# Altium schematic sheet MCP2515.SchDoc
size 297 x 209 mm
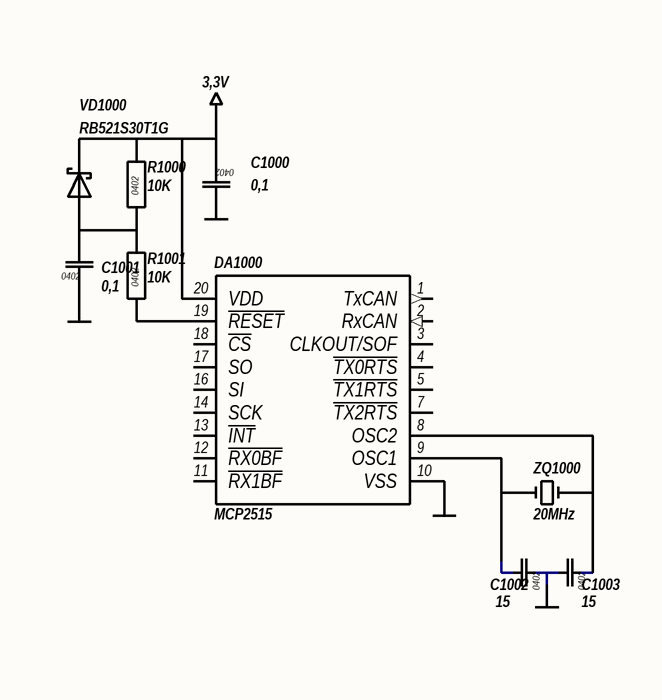
[diagram p0: MCP2515.SchDoc]

## Parts
C1000  0,1  [CAP0402]
C1001  0,1  [CAP0402]
C1002  15  [CAP0402]
C1003  15  [CAP0402]
DA1000  MCP2515  [SSOP20-4.4]
R1000  10K  [RES0402]
R1001  10K  [RES0402]
VD1000  RB521S30T1G  [SOD-523F]
ZQ1000  20MHz  [KX-7]

## Nets
3,3V: C1000.1 DA1000.20(VDD) R1000.2 VD1000.2
GND: C1000.2 C1001.1 C1002.1 C1003.2 DA1000.10(VSS)
NetC1001_2: C1001.2 R1000.1 R1001.2 VD1000.1
NetC1002_2: C1002.2 DA1000.9(OSC1) ZQ1000.3
NetC1003_1: C1003.1 DA1000.8(OSC2) ZQ1000.1
NetDA1000_19: DA1000.19(~{RESET}) R1001.1

Not connected (* = marked no-connect by the designer): DA1000 1(TxCAN) 2(RxCAN) 3(CLKOUT/SOF) 4(~{TX0RTS}) 5(~{TX1RTS}) 7(~{TX2RTS}) 11(~{RX1BF}) 12(~{RX0BF}) 13(~{INT}) 14(SCK) 16(SI) 17(SO) 18(~{CS}); ZQ1000 2 4

## Library data of the parts
C1000 C1001 = CAP_0402: Конденсатор чип; Тип корпуса: 0402; Тип монтажа: Поверхностный; Номинал: 0,1; Тип компонента: Конденсатор чип
C1002 C1003 = CAP_0402: Конденсатор чип; Напряжение: 50V; Тип корпуса: 0402; Тип монтажа: Поверхностный; Номинал: 15; Тип компонента: Конденсатор чип; Value: 15
DA1000 = MCP2515: Интерфейс CAN SPI; Производитель: Microchip; Тип корпуса: SSOP20; Тип монтажа: Поверхностный; Характеристики: 1Мб/с; Наименование: MCP2515; Тип компонента: Интерфейс CAN SPI
R1000 R1001 = RES_0402: Резистор чип; Тип корпуса: 0402; Тип монтажа: Поверхностный; Характеристики: 0.062Вт 50В; Номинал: 10K; Тип компонента: Резистор чип; Value: 10K
VD1000 = RB521S30T1G: Диод Шоттки; Производитель: ON Semiconductor; Тип корпуса: SOD523; Тип монтажа: Поверхностный; Характеристики: 30В 200мА 500мВ; Наименование: RB521S30T1G; Тип компонента: Диод Шоттки
ZQ1000 = KX-7: Кварц; Тип монтажа: Поверхностный; Производитель: Geyer; Номинал: 20MHz; Тип компонента: Кварц; Тип корпуса: KX-7